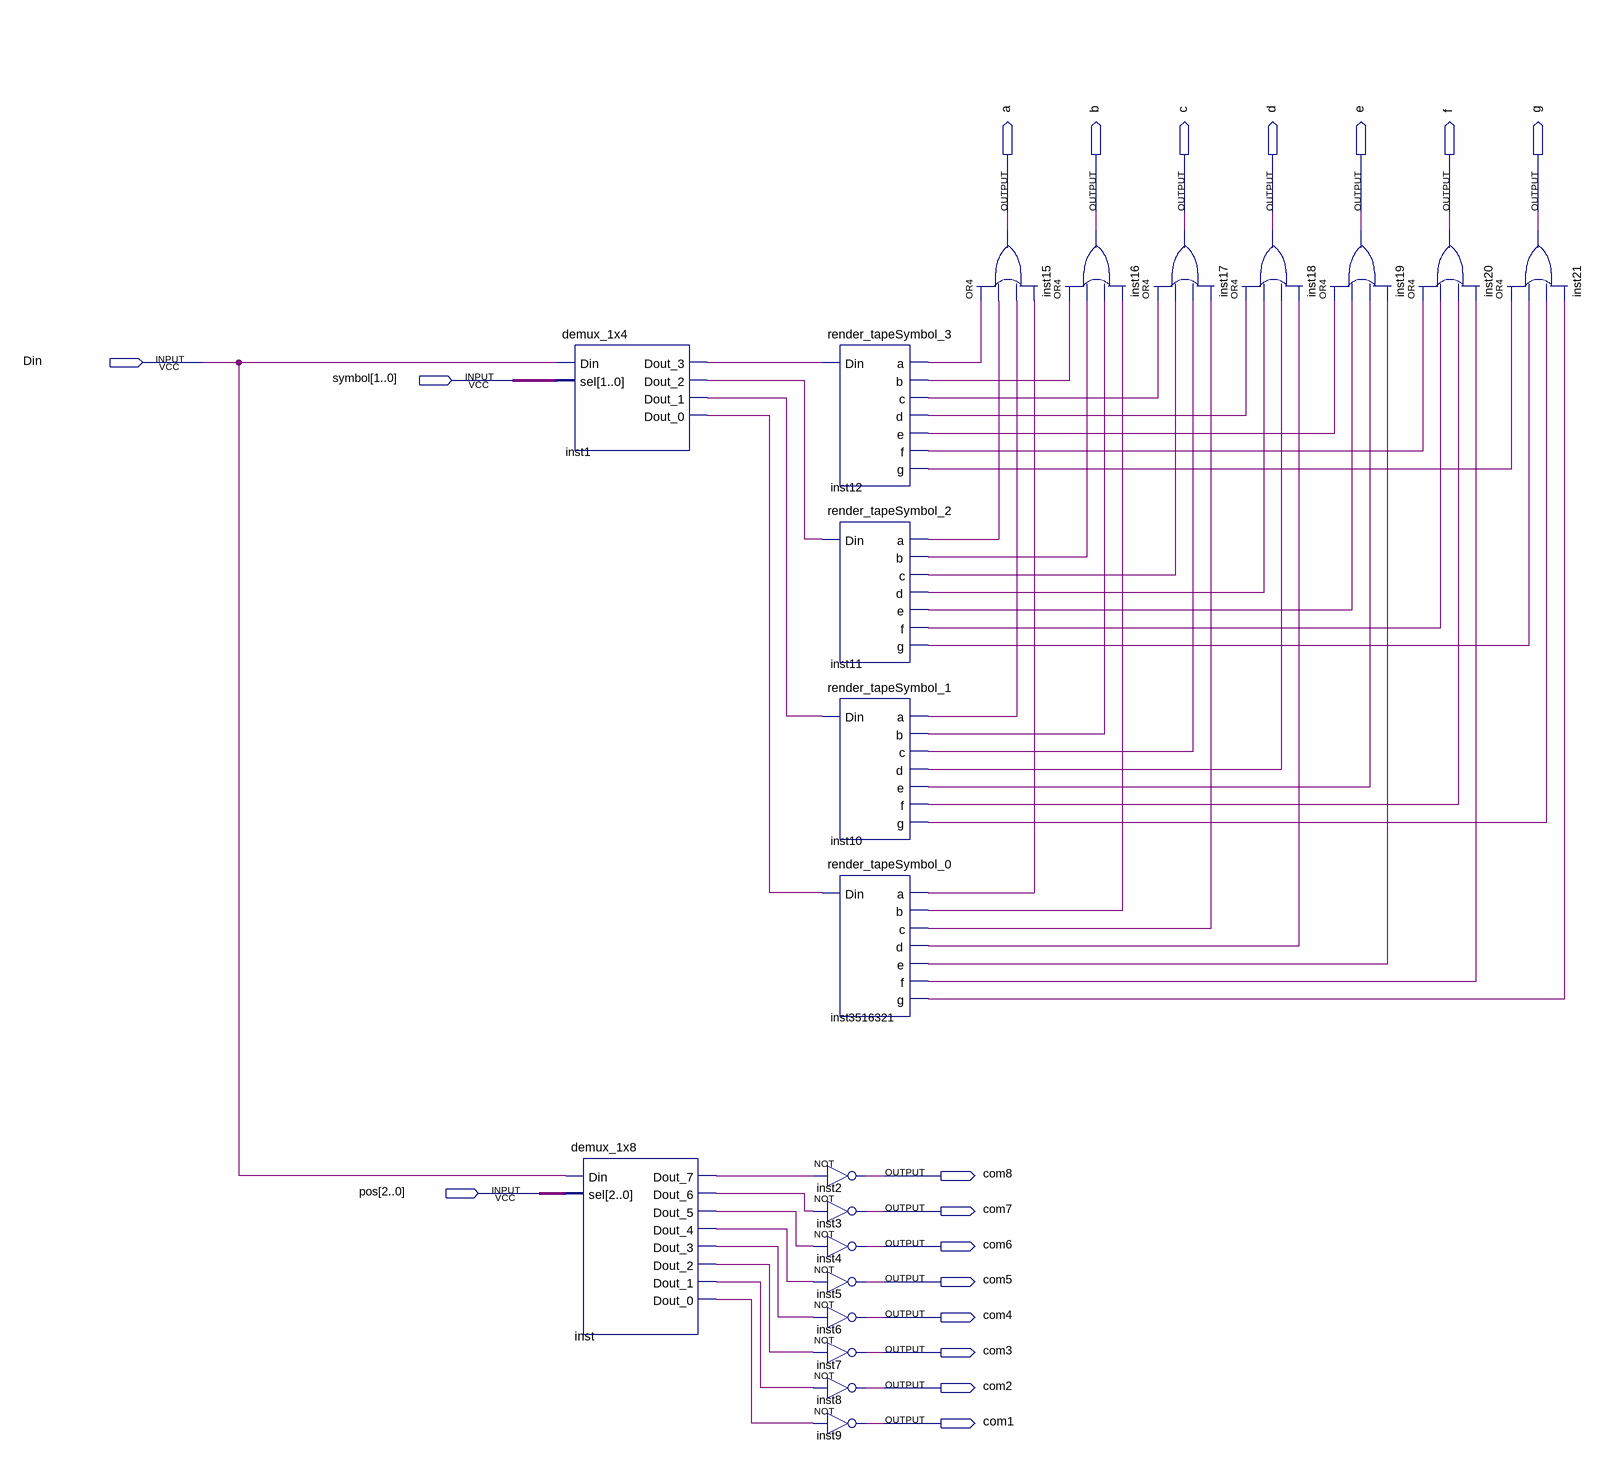
[diagram p0: schematic sheet]
// Quartus schematic render_tapeSymbol.bdf as structural Verilog: 21 symbols, 18 pins
module render_tapeSymbol (
  input  Din,
  input  [1:0] symbol,
  input  [2:0] pos,
  output a,
  output b,
  output c,
  output d,
  output e,
  output f,
  output g,
  output com8,
  output com7,
  output com6,
  output com5,
  output com4,
  output com3,
  output com2,
  output com1
);

  wire inst1_dout_0, inst1_dout_1, inst1_dout_2, inst1_dout_3, inst10_a, inst10_b, inst10_c, inst10_d,
       inst10_e, inst10_f, inst10_g, inst11_a, inst11_b, inst11_c, inst11_d, inst11_e, inst11_f, inst11_g,
       inst12_a, inst12_b, inst12_c, inst12_d, inst12_e, inst12_f, inst12_g, inst3516321_a, inst3516321_b,
       inst3516321_c, inst3516321_d, inst3516321_e, inst3516321_f, inst3516321_g, inst_dout_0, inst_dout_1,
       inst_dout_2, inst_dout_3, inst_dout_4, inst_dout_5, inst_dout_6, inst_dout_7;

  demux_1x4 inst1 (
    .Din(Din), .sel(symbol), .Dout_3(inst1_dout_3), .Dout_2(inst1_dout_2), .Dout_1(inst1_dout_1),
    .Dout_0(inst1_dout_0));
  demux_1x8 inst (
    .Din(Din), .sel(pos), .Dout_7(inst_dout_7), .Dout_6(inst_dout_6), .Dout_5(inst_dout_5),
    .Dout_4(inst_dout_4), .Dout_3(inst_dout_3), .Dout_2(inst_dout_2), .Dout_1(inst_dout_1),
    .Dout_0(inst_dout_0));
  render_tapeSymbol_3 inst12 (
    .Din(inst1_dout_3), .a(inst12_a), .b(inst12_b), .c(inst12_c), .d(inst12_d), .e(inst12_e), .f(inst12_f),
    .g(inst12_g));
  render_tapeSymbol_2 inst11 (
    .Din(inst1_dout_2), .a(inst11_a), .b(inst11_b), .c(inst11_c), .d(inst11_d), .e(inst11_e), .f(inst11_f),
    .g(inst11_g));
  render_tapeSymbol_1 inst10 (
    .Din(inst1_dout_1), .a(inst10_a), .b(inst10_b), .c(inst10_c), .d(inst10_d), .e(inst10_e), .f(inst10_f),
    .g(inst10_g));
  render_tapeSymbol_0 inst3516321 (
    .Din(inst1_dout_0), .a(inst3516321_a), .b(inst3516321_b), .c(inst3516321_c), .d(inst3516321_d),
    .e(inst3516321_e), .f(inst3516321_f), .g(inst3516321_g));
  not inst2 (com8, inst_dout_7);
  not inst3 (com7, inst_dout_6);
  not inst4 (com6, inst_dout_5);
  not inst5 (com5, inst_dout_4);
  not inst6 (com4, inst_dout_3);
  not inst7 (com3, inst_dout_2);
  not inst8 (com2, inst_dout_1);
  not inst9 (com1, inst_dout_0);
  or inst15 (a, inst12_a, inst11_a, inst10_a, inst3516321_a);
  or inst16 (b, inst12_b, inst11_b, inst10_b, inst3516321_b);
  or inst17 (c, inst12_c, inst11_c, inst10_c, inst3516321_c);
  or inst18 (d, inst12_d, inst11_d, inst10_d, inst3516321_d);
  or inst19 (e, inst12_e, inst11_e, inst10_e, inst3516321_e);
  or inst20 (f, inst12_f, inst11_f, inst10_f, inst3516321_f);
  or inst21 (g, inst12_g, inst11_g, inst10_g, inst3516321_g);
endmodule
